# Altium schematic sheet Lights Tester.SchDoc
size Letter
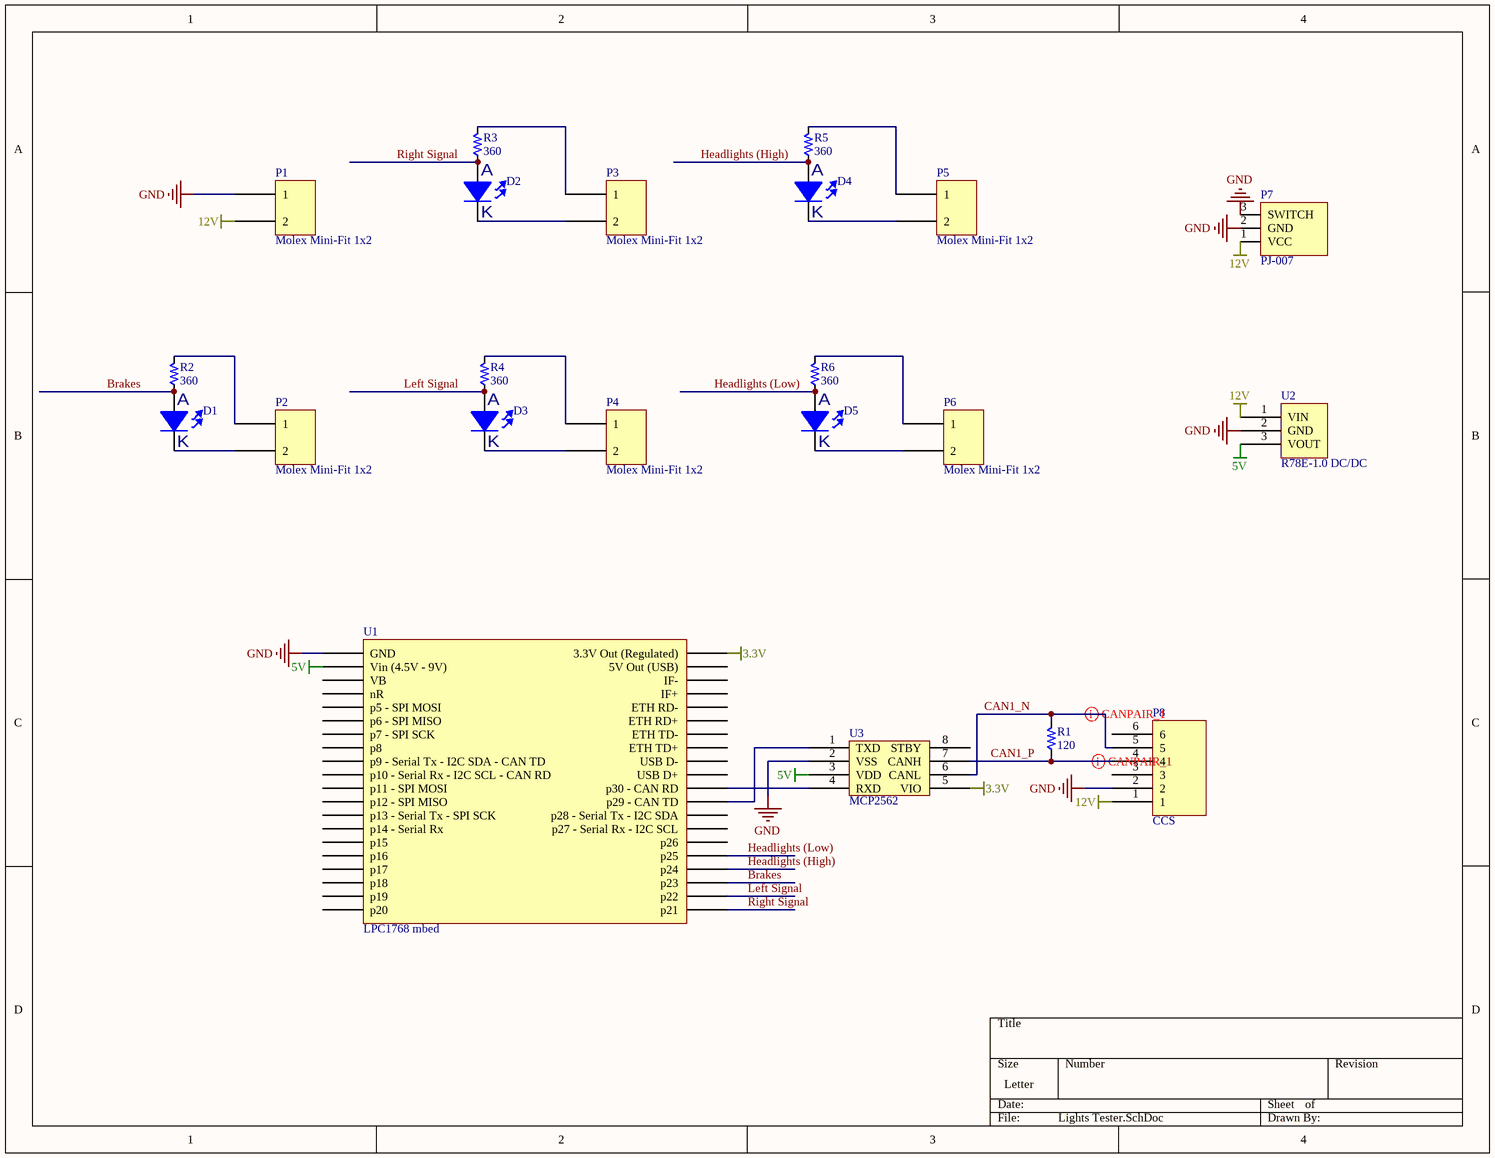
[diagram p0: Lights Tester.SchDoc]

## Parts
D1  LED RED  [RED LED]  (value not drawn)
D2  LED RED  [RED LED]  (value not drawn)
D3  LED RED  [RED LED]  (value not drawn)
D4  LED RED  [RED LED]  (value not drawn)
D5  LED RED  [RED LED]  (value not drawn)
P1  Molex Mini-Fit 1x2  [Molex Mini-Fit Jr 2x1]
P2  Molex Mini-Fit 1x2  [Molex Mini-Fit Jr 2x1]
P3  Molex Mini-Fit 1x2  [Molex Mini-Fit Jr 2x1]
P4  Molex Mini-Fit 1x2  [Molex Mini-Fit Jr 2x1]
P5  Molex Mini-Fit 1x2  [Molex Mini-Fit Jr 2x1]
P6  Molex Mini-Fit 1x2  [Molex Mini-Fit Jr 2x1]
P7  PJ-007  [BARREL JACK PJ007]
P8  CCS  [PCB_MLX_MICROFIT_3X2]
R1  120  [PCB_GENERIC_SMD_0603]
R2  Resistance: 360  [PCB_GENERIC_SMD_0603]  (hidden comment: SCH_GENERIC_RESISTOR_0603)
R3  Resistance: 360  [PCB_GENERIC_SMD_0603]  (hidden comment: SCH_GENERIC_RESISTOR_0603)
R4  Resistance: 360  [PCB_GENERIC_SMD_0603]  (hidden comment: SCH_GENERIC_RESISTOR_0603)
R5  Resistance: 360  [PCB_GENERIC_SMD_0603]  (hidden comment: SCH_GENERIC_RESISTOR_0603)
R6  Resistance: 360  [PCB_GENERIC_SMD_0603]  (hidden comment: SCH_GENERIC_RESISTOR_0603)
U1  LPC1768 mbed  [LPC 1768 mbed Layout]
U2  R78E-1.0 DC/DC  [R78-1.0]
U3  MCP2562  [MCP2562]

## Nets
3.3V: U1.40(3.3V_Out_(Regulated)) U3.5(VIO)
5V: U1.2(Vin_(4.5V_-_9V)) U2.3(VOUT) U3.3(VDD)
12V: P1.2 P7.1(VCC) P8.1 U2.1(VIN)
GND: P1.1 P7.2(GND) P7.3(SWITCH) P8.2 U1.1(GND) U2.2(GND) U3.2(VSS)
Brakes: D1.2 R2.1 U1.23(p23)
CAN1_N: P8.5 R1.2 U3.6(CANL)
CAN1_P: P8.4 R1.1 U3.7(CANH)
Headlights (High): D4.2 R5.1 U1.24(p24)
Headlights (Low): D5.2 R6.1 U1.25(p25)
Left Signal: D3.2 R4.1 U1.22(p22)
Right Signal: D2.2 R3.1 U1.21(p21)
NetD1_1: D1.1 P2.2
NetD2_1: D2.1 P3.2
NetD3_1: D3.1 P4.2
NetD4_1: D4.1 P5.2
NetD5_1: D5.1 P6.2
NetP2_1: P2.1 R2.2
NetP3_1: P3.1 R3.2
NetP4_1: P4.1 R4.2
NetP5_1: P5.1 R5.2
NetP6_1: P6.1 R6.2
NetU1_29: U1.29(p29_-_CAN_TD) U3.1(TXD)
NetU1_30: U1.30(p30_-_CAN_RD) U3.4(RXD)

Not connected (* = marked no-connect by the designer): P8 3 6; U1 3(VB) 4(nR) 5(p5_-_SPI_MOSI) 6(p6_-_SPI_MISO) 7(p7_-_SPI_SCK) 8(p8) 9(p9_-_Serial_Tx_-_I2C_SDA_-_CAN_TD) 10(p10_-_Serial_Rx_-_I2C_SCL_-_CAN_RD) 11(p11_-_SPI_MOSI) 12(p12_-_SPI_MISO) 13(p13_-_Serial_Tx_-_SPI_SCK) 14(p14_-_Serial_Rx) 15(p15) 16(p16) 17(p17) 18(p18) 19(p19) 20(p20) 26(p26) 27(p27_-_Serial_Rx_-_I2C_SCL) 28(p28_-_Serial_Tx_-_I2C_SDA) 31(USB_D+) 32(USB_D-) 33(ETH_TD+) 34(ETH_TD-) 35(ETH_RD+) 36(ETH_RD-) 37(IF+) 38(IF-) 39(5V_Out_(USB)); U3 8(STBY)

## Layout directives
differential pair: CAN1_N, CAN1_P

## Notes on the sheet
- (in symbol LED RED) A; K

## Library data of the parts
P7 = Component_1
P8 = SCH_MLX_MICROFIT_3X2
R1 = SCH_GENERIC_RESISTOR_0603: 120 Ohms; Resistance: 120
R2-R6 = SCH_GENERIC_RESISTOR_0603: Generic SMD resistor 0603
U2 = R78E-1.0